# Altium schematic sheet PROB_S7CAS_Connectors.SchDoc
size Tabloid; SheetNumber: 2; SheetTotal: 15; Sheet_Name: Connectors; Size: 11x17
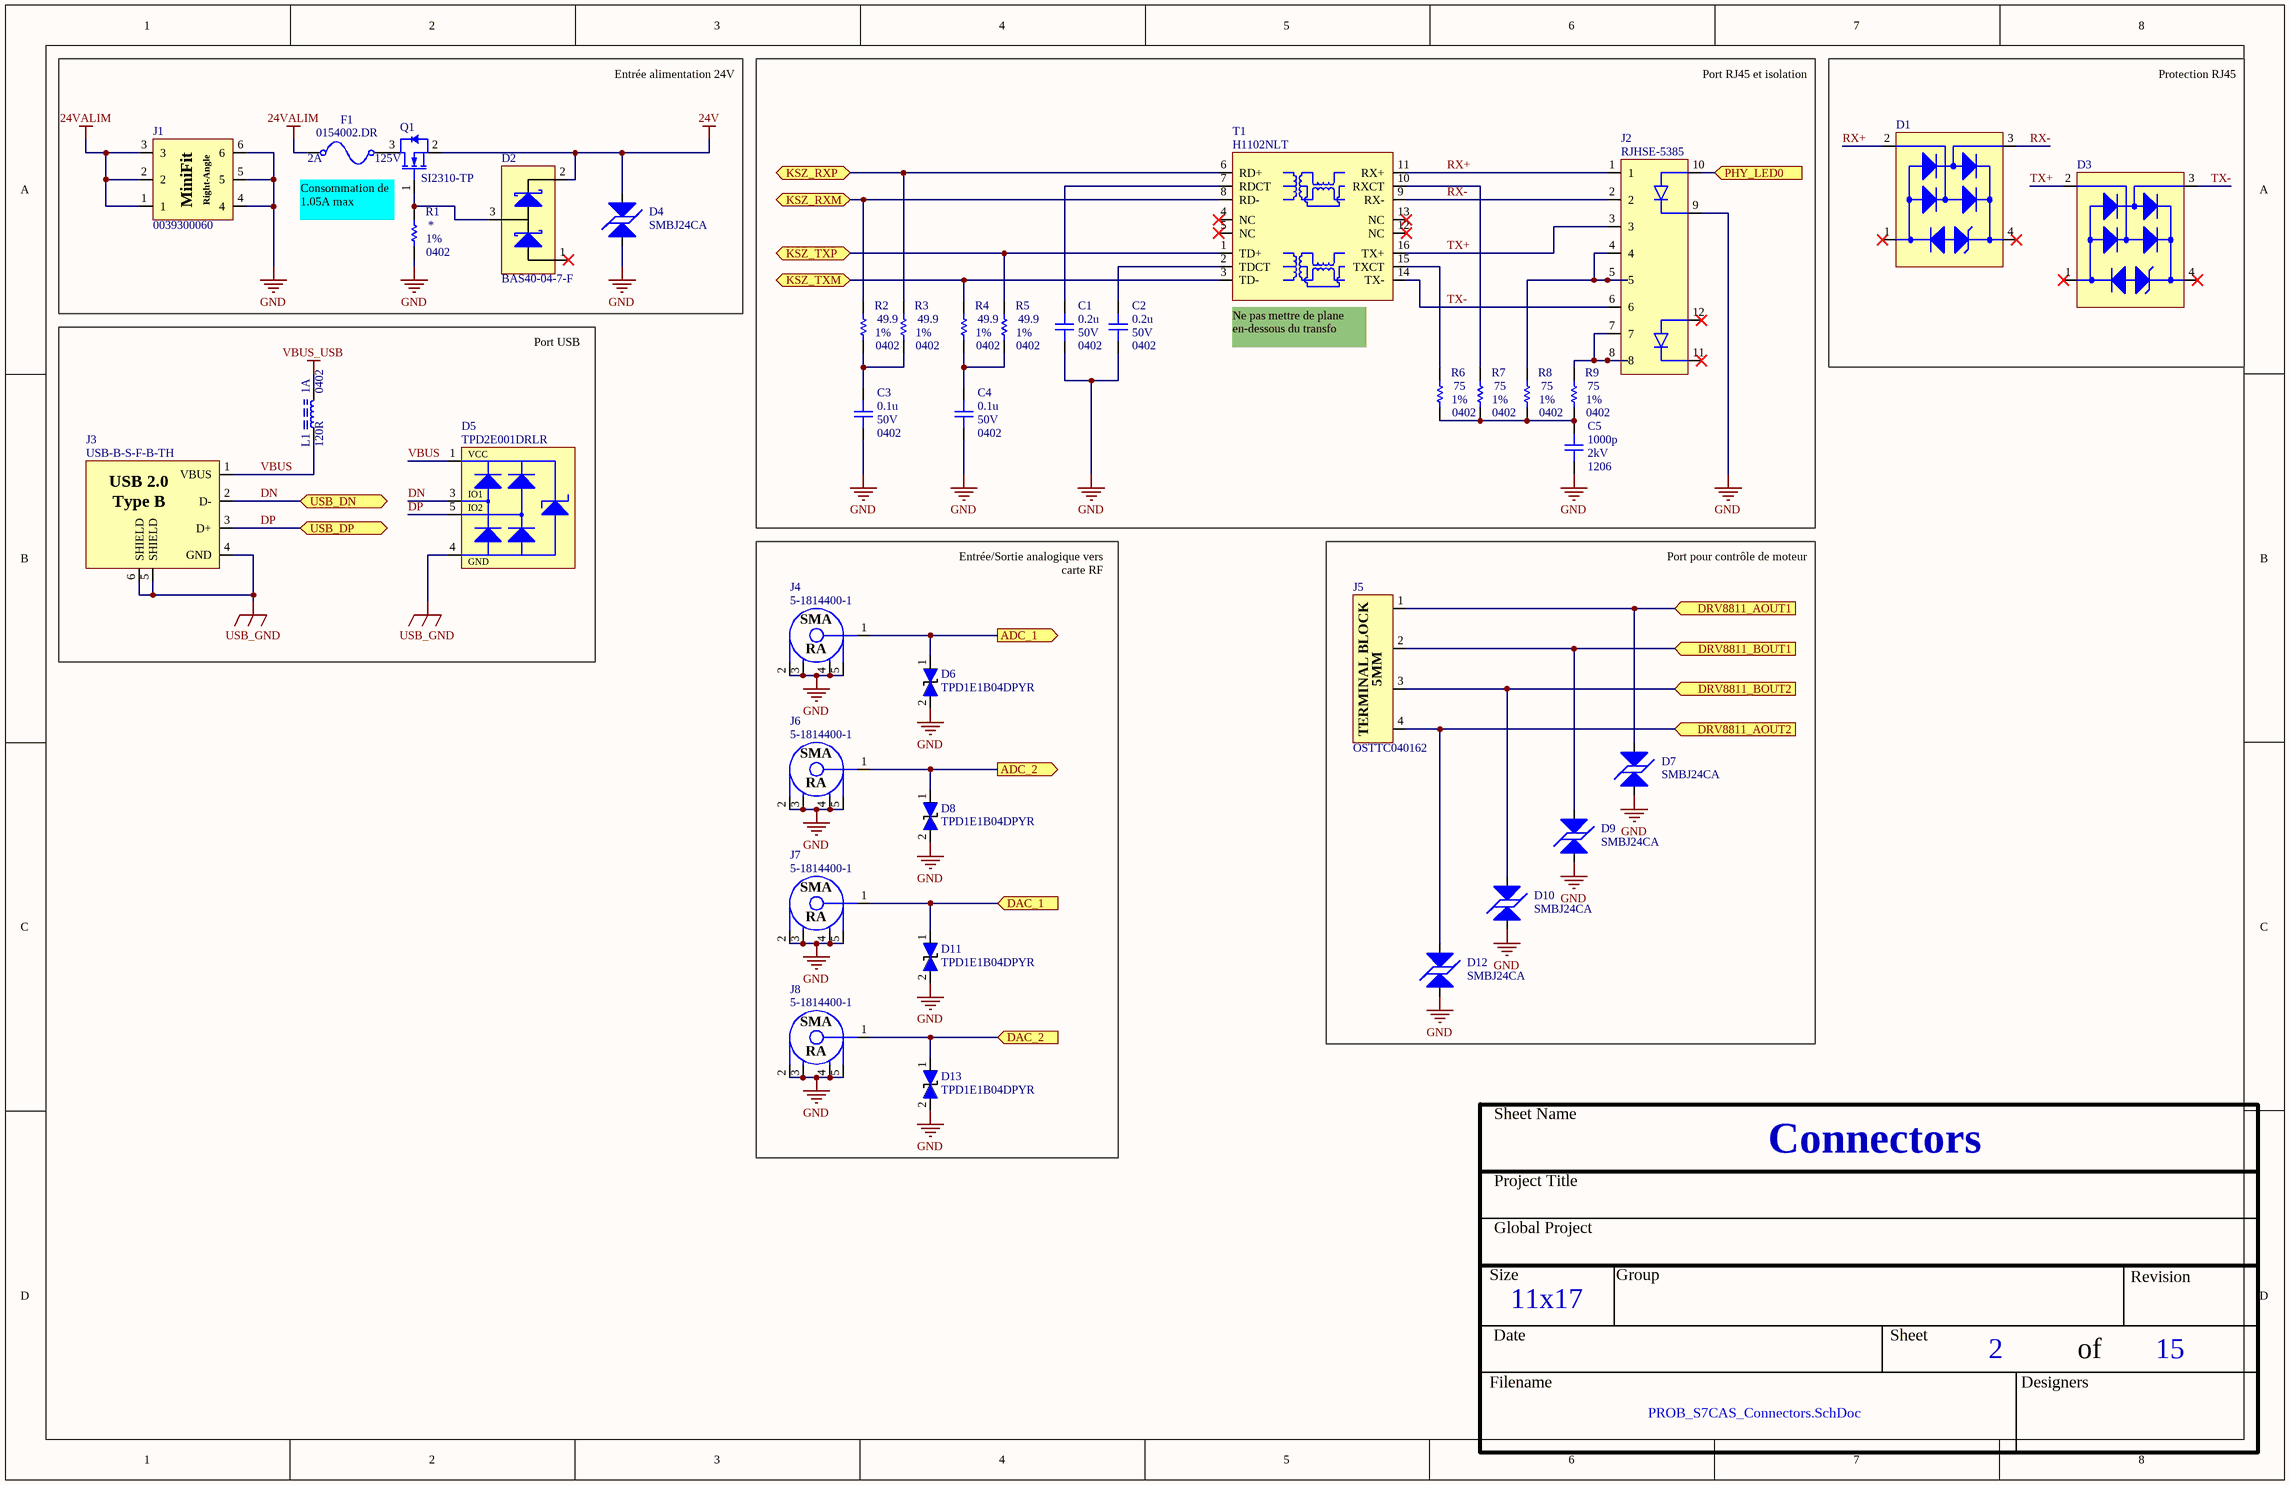
[diagram p0: PROB_S7CAS_Connectors.SchDoc]

## Parts
C1  value 0.2u  Voltage: 50V  Package: 0402  [CAP_0402]  (hidden comment: CAP - 0402)
C2  value 0.2u  Voltage: 50V  Package: 0402  [CAP_0402]  (hidden comment: CAP - 0402)
C3  value 0.1u  Voltage: 50V  Package: 0402  [CAP_0402]  (hidden comment: CAP - 0402)
C4  value 0.1u  Voltage: 50V  Package: 0402  [CAP_0402]  (hidden comment: CAP - 0402)
C5  value 1000p  Voltage: 2kV  Package: 1206  [CAP_0402]  (hidden comment: CAP - 0402)
D1  SR3.3.TCT  [TVS_SR3.3.TCT]  (value not drawn)
D2  BAS40-04-7-F  [DIO_SCHOTTKY_BAS40-04-7-F]
D3  SR3.3.TCT  [TVS_SR3.3.TCT]  (value not drawn)
D4  SMBJ24CA  [TVS_PWR_SMBJ36CA]
D5  TPD2E001DRLR  [TVS_USB_TPD2E001DRLR]
D6  TPD1E1B04DPYR  [TVS_DATA_TPD1E1B04DPYR]
D7  SMBJ24CA  [TVS_PWR_SMBJ36CA]
D8  TPD1E1B04DPYR  [TVS_DATA_TPD1E1B04DPYR]
D9  SMBJ24CA  [TVS_PWR_SMBJ36CA]
D10  SMBJ24CA  [TVS_PWR_SMBJ36CA]
D11  TPD1E1B04DPYR  [TVS_DATA_TPD1E1B04DPYR]
D12  SMBJ24CA  [TVS_PWR_SMBJ36CA]
D13  TPD1E1B04DPYR  [TVS_DATA_TPD1E1B04DPYR]
F1  0154002.DR  Voltage Rating: 125V  Current Rating: 2A  [FUS_0154XXX.DR]
J1  0039300060  [CON_MINIFIT_0039300060]
J2  RJHSE-5385  [CONN_ETHERNET_RJHSE-5385]
J3  USB-B-S-F-B-TH  [CON_USB_USB-B-S-F-B-TH]
J4  5-1814400-1  [CONN_SMA_5-1814400-1]
J5  OSTTC040162  [CONN_TERMINAL_OSTTA040161]
J6  5-1814400-1  [CONN_SMA_5-1814400-1]
J7  5-1814400-1  [CONN_SMA_5-1814400-1]
J8  5-1814400-1  [CONN_SMA_5-1814400-1]
L1  value 120R  Current: 1A  Package: 0402  [FER_0402]  (hidden comment: FER - 0402)
Q1  SI2310-TP  [TRX_NMOS_SI2310-TP]
R1  Package: 0402  Precision: 1%  [RES_0402]  (hidden comment: RES - 0402)
R2  value 49.9  Package: 0402  Precision: 1%  [RES_0402]  (hidden comment: RES - 0402)
R3  value 49.9  Package: 0402  Precision: 1%  [RES_0402]  (hidden comment: RES - 0402)
R4  value 49.9  Package: 0402  Precision: 1%  [RES_0402]  (hidden comment: RES - 0402)
R5  value 49.9  Package: 0402  Precision: 1%  [RES_0402]  (hidden comment: RES - 0402)
R6  value 75  Package: 0402  Precision: 1%  [RES_0402]  (hidden comment: RES - 0402)
R7  value 75  Package: 0402  Precision: 1%  [RES_0402]  (hidden comment: RES - 0402)
R8  value 75  Package: 0402  Precision: 1%  [RES_0402]  (hidden comment: RES - 0402)
R9  value 75  Package: 0402  Precision: 1%  [RES_0402]  (hidden comment: RES - 0402)
T1  H1102NLT  [TRANSFO_H1102NLT]

## Ports
ADC_1 (out), ADC_2 (out), DAC_1 (in), DAC_2 (in), DRV8811_AOUT1 (in), DRV8811_AOUT2 (in), DRV8811_BOUT1 (in), DRV8811_BOUT2 (in), KSZ_RXM (bidir), KSZ_RXP (bidir), KSZ_TXM (bidir), KSZ_TXP (bidir), PHY_LED0 (in), USB_DN (bidir), USB_DP (bidir)

## Nets
24V: D2.2(K) D4.1 Q1.2(S)
24VALIM: F1.1 J1.1 J1.2 J1.3
GND: C1.1 C2.1 C3.1 C4.1 C5.1 D4.2 D6.2(i/o) D7.2 D8.2(i/o) D9.2 D10.2 D11.2(i/o) D12.2 D13.2(i/o) J1.4 J1.5 J1.6 J2.9(LED1_K) J4.2 J4.3 J4.4 J4.5 J6.2 J6.3 J6.4 J6.5 J7.2 J7.3 J7.4 J7.5 J8.2 J8.3 J8.4 J8.5 R1.1
USB_GND: D5.4(GND) J3.4(GND) J3.5(SHIELD) J3.6(SHIELD)
VBUS_USB: L1.1
ADC_1: D6.1(i/o) J4.1 ; port ADC_1
ADC_2: D8.1(i/o) J6.1 ; port ADC_2
DAC_1: D11.1(i/o) J7.1 ; port DAC_1
DAC_2: D13.1(i/o) J8.1 ; port DAC_2
DN: D5.3(IO1) J3.2(D-) ; port USB_DN
DP: D5.5(IO2) J3.3(D+) ; port USB_DP
DRV8811_AOUT1: D7.1 J5.1 ; port DRV8811_AOUT1
DRV8811_AOUT2: D12.1 J5.4 ; port DRV8811_AOUT2
DRV8811_BOUT1: D9.1 J5.2 ; port DRV8811_BOUT1
DRV8811_BOUT2: D10.1 J5.3 ; port DRV8811_BOUT2
KSZ_RXM: R2.2 T1.8(RD-) ; port KSZ_RXM
KSZ_RXP: R3.2 T1.6(RD+) ; port KSZ_RXP
KSZ_TXM: R4.2 T1.3(TD-) ; port KSZ_TXM
KSZ_TXP: R5.2 T1.1(TD+) ; port KSZ_TXP
PHY_LED0: J2.10(LED1_A) ; port PHY_LED0
RX+: D1.2(VN) J2.1 T1.11(RX+)
RX-: D1.3 J2.2 T1.9(RX-)
TX+: D3.2(VN) J2.3 T1.16(TX+)
TX-: D3.3 J2.6 T1.14(TX-)
VBUS: D5.1(VCC) J3.1(VBUS) L1.2
NetC1_2: C1.2 T1.7(RDCT)
NetC2_2: C2.2 T1.2(TDCT)
NetC3_2: C3.2 R2.1 R3.1
NetC4_2: C4.2 R4.1 R5.1
NetC5_2: C5.2 R6.1 R7.1 R8.1 R9.1
NetD2_3: D2.3(AK) Q1.1(G) R1.2
NetF1_2: F1.2 Q1.3(D)
NetJ2_4: J2.4 J2.5 R8.2
NetJ2_7: J2.7 J2.8 R9.2
NetR6_2: R6.2 T1.15(TXCT)
NetR7_2: R7.2 T1.10(RXCT)

Not connected (* = marked no-connect by the designer): D1 1(I/O)* 4*; D2 1(A)*; D3 1(I/O)* 4*; D5 2(NC); J2 11(LED2_K)* 12(LED2_A)*; T1 4(NC)* 5(NC)* 12(NC)* 13(NC)*

## Notes on the sheet
- Entrée alimentation 24V
- Port RJ45 et isolation
- Protection RJ45
- (near Q1) Consommation de 1.05A max
- Port USB
- (near T1) Ne pas mettre de plane en-dessous du transfo
- Entrée/Sortie analogique vers carte RF
- Port pour contrôle de moteur
- Sheet Name
- Project Title
- Global Project
- Size
- Group
- Revision
- Date
- Sheet
- of
- Filename
- Designers
- (in symbol CON_MINIFIT_0039300060) MiniFit; Right-Angle
- (in symbol CON_USB_USB-B-S-F-B-TH) USB 2.0; Type B
- (in symbol CONN_SMA_5-1814400-1) SMA; RA
- (in symbol CONN_TERMINAL_OSTTC040162) TERMINAL BLOCK; 5MM

## Library data of the parts
C1-C5 = CAP - 0402: Precision: 10%; Current: *; CreatedBy: Jonathan Bouchard; Power: *
D1 D3 = TVS_SR3.3.TCT: TVS - DIODE ARRAY 3.3V 150W - SOT143-4; Mfg: Semtech; Voltage: VBR=3.3V; Current: *; Mfg Part Number: SR3.3.TCT; HelpURL: http://www.semtech.com/images/datasheet/sr3.3.pdf; CreatedBy: Jonathan Bouchard; Temperature: -55°C to 125°C; Power: 150W; Package: SOT143-4; Precision: *; Value: *; Supplier 1: Digikey; Supplier Part Number 1: SR3.3DKR-ND
D2 = DIO_SCHOTTKY_BAS40-04-7-F: DIO - Schottky Array 1 Pair Series Connection - SOT-23-3; Manufacturer #1: Diodes Incorporated; Voltage Rating: 40V dc reverse; Current Rating: 200mA; GRAMS Lib Spec: 2.8; Magnetic Material: Unknown; Polarized: Yes; Value: -; Tolerance: -; Power Max: -; HelpURL: https://www.diodes.com/assets/Datasheets/ds11006.pdf; CreatedBy/Date: Danae D-F 15 août 2019; VerifiedBy: C.Paulin - 16/08/2019; Temperature: -55°C ~ 125°C; Package: SOT-23-3; Manufacturer #2: -; Assembly Type: SMD; Part Number #2: -; Part Number #1: BAS40-04-7-F; Supplier 1: Digi-Key; Supplier Part Number 1: BAS40-04FDITR-ND; Cryo: UNKNOWN
D4 D7 D9 D10 D12 = TVS_PWR_SMBJ24CA: TVS - 24V 26.7V 600W - DO214AA; Manufacturer #1: Littelfuse Inc.; Value: Vbr = 26.7V -  Clamp = 38.9V; Voltage Rating: 24V Standoff; Current Rating: 15.5A; GRAMS Lib Spec: 2.8; Magnetic Material: UNKNOWN; Polarized: NO; Tolerance: *; Power Max: 600W; HelpURL: http://www.littelfuse.com/~/media/electronics/datasheets/tvs_diodes/littelfuse_tvs_diode_smbj_datasheet.pdf.pdf; CreatedBy/Date: Arnaud Samson - 06/07/18; VerifiedBy: Jonathan Bouchard - 2018-07-13; Temperature: -65°C ~ 150°C (TJ); Package: DO214AA; Manufacturer #2: *; Note: *; Assembly Type: SMD; Part Number #2: *; Part Number #1: SMBJ24CA; Supplier 1: Digi-Key; Supplier Part Number 1: SMBJ24CALFCT-ND; Cryo: UNKNOWN
D5 = TVS_USB_TPD2E001DRLR: TVS - USB TVS DIODE 5.5V - SOT-553; Manufacturer #1: Texas Instruments; Value: 11V Breakdown; Voltage Rating: 5.5V (Max); GRAMS Lib Spec: 2.8; Magnetic Material: YES; Cryo: UNKNOWN; Tolerance: *; Current Rating: *; Power Max: *; HelpURL: http://www.ti.com/lit/ds/symlink/tpd2e001.pdf; CreatedBy/Date: Jonathan Bouchard 2018-07-10; VerifiedBy: Arnaud Samson 16-07-18; Temperature: -40°C ~ 85°C (TA); Package: SOT-553; Manufacturer #2: *; Note: *; Assembly Type: SMD; Part Number #2: *; Part Number #1: TPD2E001DRLR; Polarized: YES; Supplier 1: Digi-Key; Supplier Part Number 1: 296-21883-1-ND
D6 D8 D11 D13 = TVS_DATA_TPD1E1B04DPYR: TVS - TVS DIODE 3.6V 8.5V - 0402; Manufacturer #1: Texas Instruments; Current Rating: 6.3Apeak; Power Max: 50Wpeak; GRAMS Lib Spec: 2.8; Magnetic Material: Unknown; Polarized: No; Value: *; Tolerance: *; Voltage Rating: 3.6V; HelpURL: http://www.ti.com/lit/ds/symlink/tpd1e1b04.pdf; CreatedBy/Date: Keven Deslandes - 2018/10/19; VerifiedBy: Caroline Paulin - 28 janv 2019; Temperature: -40°C ~ 125°C (TA); Package: 0402; Manufacturer #2: *; Note: *; Assembly Type: SMD; Part Number #2: *; Part Number #1: TPD1E1B04DPYR; Supplier 1: Digi-Key; Supplier Part Number 1: 296-47364-1-ND; Cryo: UNKNOWN
F1 = FUS_0154002.DR: FUS - 2 A 125 VAC/VDC - 2-SMD; Manufacturer #1: Littelfuse Inc.; Value: 2A 125V AC/DC FAST; GRAMS Lib Spec: 2.8; Magnetic Material: UNKNOWN; Polarized: NO; Tolerance: *; Power Max: *; HelpURL: http://www.littelfuse.com/~/media/electronics/datasheets/fuses/littelfuse_fuse_154_154t_154l_154tl_datasheet.pdf.pdf; CreatedBy/Date: Jonathan Bouchard 2018-07-17; VerifiedBy: Arnaud Samson 23-07-18; Temperature: -55°C ~ 125°C; Package: 2-SMD; Manufacturer #2: *; Note: *; Assembly Type: SMD; Part Number #2: *; Part Number #1: 0154002.DR; Supplier 1: Digi-Key; Supplier Part Number 1: F1224CT-ND; Cryo: UNKNOWN
J1 = CON_MINIFIT_0039300060: CON - Mini-Fit Through Hole, Right Angle 6 position; Manufacturer #1: Molex; Current Rating: 8A; GRAMS Lib Spec: 2.8; Magnetic Material: Unknown; Polarized: Yes; Voltage Rating: 600V; Assembly Type: TH; CreatedBy/Date: Joel Lemay 2018-06-21; HelpURL: https://www.molex.com/pdm_docs/sd/039300060_sd.pdf; Manufacturer #2: *; Package: TH; Part Number #1: 0039300060; Part Number #2: *; Power Max: *; Supplier 1: Digi-Key; Supplier Part Number 1: WM21353-ND; Temperature: - 40°C to + 80°C; Tolerance: *; Value: *; VerifiedBy: Caroline Paulin - 10 sept 2018; Cryo: UNKNOWN
J2 = CONN_ETHERNET_RJHSE-5385: CONN - MOD JACK RJ45 R/A ETHERNET - TH; Mfg: Amphenol; Voltage: *; Current: *; Power: *; Mfg Part Number: RJHSE-5385; HelpURL: https://www.amphenolcanada.com/ProductSearch/drawings/AC/RJHSE538X.pdf; CreatedBy: Jonathan Bouchard; Temperature: -55°C ~ 85°C; Value: *; Precision: *; Package: TH-12; Supplier 1: Digikey; Supplier Part Number 1: RJHSE-5385-ND
J3 = CON_USB_USB-B-S-F-B-TH: CON - USB B RECPT TH R/A - 4-TH; Manufacturer #1: Samtec Inc.; Value: USB B; Voltage Rating: 30VAC; GRAMS Lib Spec: 2.8c; Magnetic Material: UNKNOWN; Polarized: YES; Tolerance: *; Current Rating: *; Power Max: *; HelpURL: http://suddendocs.samtec.com/catalog_english/usb_b.pdf; CreatedBy/Date: Jonathan Bouchard 2020-03-24; VerifiedBy: C.Paulin - 22/04/2020; Temperature: -50°C ~ 85°C; Package: 4-TH; Manufacturer #2: *; Note: *; Assembly Type: TH; Part Number #2: *; Part Number #1: USB-B-S-F-B-TH; Supplier 1: Digi-Key; Supplier Part Number 1: SAM10867-ND; Cryo: UNKNOWN
J4 J6-J8 = CONN_SMA_5-1814400-1: CONN -  SMA JACK R/A 50 OHM - TH; Mfg: TE Connectivity AMP Connectors; Voltage: *; Current: *; Power: *; Mfg Part Number: 5-1814400-1; HelpURL: http://www.te.com/commerce/DocumentDelivery/DDEController?Action=srchrtrv&DocNm=1814400&DocType=Customer+Drawing&DocLang=English; CreatedBy: Jonathan Bouchard; Temperature: -55°C ~ 85°C; Value: *; Precision: *; Package: TH-5; Supplier 1: Digikey; Supplier Part Number 1: A97593-ND
J5 = CONN_TERMINAL_OSTTC040162: CONN -  TERMINAL BLOCK 4POS 5MM - TH; Mfg: On Shore Technology Inc.; Voltage: *; Current: *; Power: *; Mfg Part Number: OSTTC040162; HelpURL: http://www.on-shore.com/wp-content/uploads/2015/09/osttcxx0162.pdf; CreatedBy: Jonathan Bouchard; Temperature: -30°C ~ 105°C; Value: *; Precision: *; Package: TH-4; Supplier 1: Digikey; Supplier Part Number 1: ED2602-ND
Q1 = TRX_NMOS_SI2310-TP: TRX - MOSFET N-CH 60V 3A - SOT-23; Manufacturer #1: Micro Commercial Co; Power Max: 350mW; Voltage rating: 60V (Vds max), 2V (Vgs @ 250uA); Polarized: Yes; Magnetic Material: UNKNOWN; GRAMS Lib Spec: 2.8c; Current Rating: 3A; Manufacturer #2: *; Value: *; Part Number #1: SI2310-TP; Part Number #2: *; HelpURL: https://www.mccsemi.com/pdf/Products/SI2310(SOT-23)-A.pdf; Supplier 1: Digi-Key; Supplier Part Number 1: SI2310-TPMSCT-ND; Assembly Type: SMD; Temperature: -55°C ~ 150°C (TJ); Package: SOT-23; CreatedBy/Date: Louis-Daniel Gaulin / 20-02-2020; Tolerance: *; VerifiedBy: C.Paulin - 21/02/2020; Cryo: UNKNOWN
R1-R9 = RES - 0402: Voltage: 50V; Power: 1/16W; Current: *; CreatedBy: Jonathan Bouchard
  R1: Value: *
T1 = TRANSFO_H1102NLT: TRANSFO - ETHERNET 10/100B-TX - SMD-16; Mfg: Pulse Eng.; Value: 1:1 (350uH); Voltage: *; Current: *; Power: *; Mfg Part Number: H1102NLT; HelpURL: http://media.digikey.com/pdf/Data%20Sheets/Pulse%20PDFs/10_100BASE-T%20Single%20Port%20SMD%20Magnetics_Rev2008.pdf; CreatedBy: Jonathan Bouchard; Temperature: -40°C to 85°C; Precision: *; Package: SMD-16; Supplier 1: Digikey; Supplier Part Number 1: 553-1532-1-ND
L1 = FER - 0402: Voltage: *; CreatedBy: Jonathan Bouchard; Power: *; Precision: *